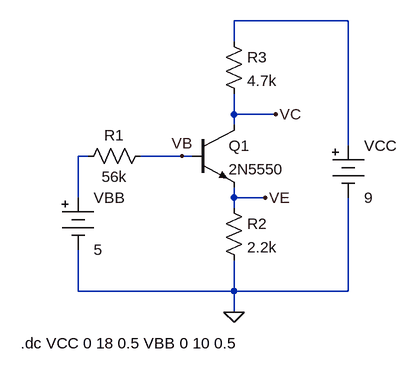
[diagram p0: schematic tp3-ej6.asc]
tp3-ej6.asc, the LTspice schematic file:
Version 4
SHEET 1 880 680
WIRE 512 -160 336 -160
WIRE 336 -128 336 -160
WIRE 336 -16 336 -48
WIRE 400 -16 336 -16
WIRE 336 0 336 -16
WIRE 512 32 512 -160
WIRE 112 48 96 48
WIRE 256 48 192 48
WIRE 272 48 256 48
WIRE 96 112 96 48
WIRE 336 112 336 96
WIRE 384 112 336 112
WIRE 336 128 336 112
WIRE 96 256 96 192
WIRE 336 256 336 208
WIRE 336 256 96 256
WIRE 512 256 512 112
WIRE 512 256 336 256
WIRE 336 288 336 256
FLAG 336 288 0
FLAG 256 48 VB
FLAG 400 -16 VC
FLAG 384 112 VE
SYMBOL res 96 64 R270
WINDOW 0 32 56 VTop 2
WINDOW 3 0 56 VBottom 2
SYMATTR InstName R1
SYMATTR Value 56k
SYMBOL res 320 112 R0
SYMATTR InstName R2
SYMATTR Value 2.2k
SYMBOL res 320 -144 R0
SYMATTR InstName R3
SYMATTR Value 4.7k
SYMBOL npn 272 0 R0
SYMATTR InstName Q1
SYMATTR Value 2N5550
SYMBOL Misc\\battery 96 96 R0
WINDOW 123 0 0 Left 0
WINDOW 39 0 0 Left 0
SYMATTR InstName VBB
SYMATTR Value 5
SYMBOL Misc\\battery 512 16 R0
WINDOW 123 0 0 Left 0
WINDOW 39 0 0 Left 0
SYMATTR InstName VCC
SYMATTR Value 9
TEXT 8 336 Left 2 !.dc VCC 0 18 0.5 VBB 0 10 0.5

The netlist it stands for:
* tp3-ej6.asc
R1 N002 VB 56k
R2 VE 0 2.2k
R3 N001 VC 4.7k
Q1 VC VB VE 0 2N5550
VBB N002 0 5
VCC N001 0 9
.model NPN NPN
.model PNP PNP
.lib standard.bjt
.dc VCC 0 18 0.5 VBB 0 10 0.5
.backanno
.end